# Altium schematic sheet Sensor.SchDoc
size A
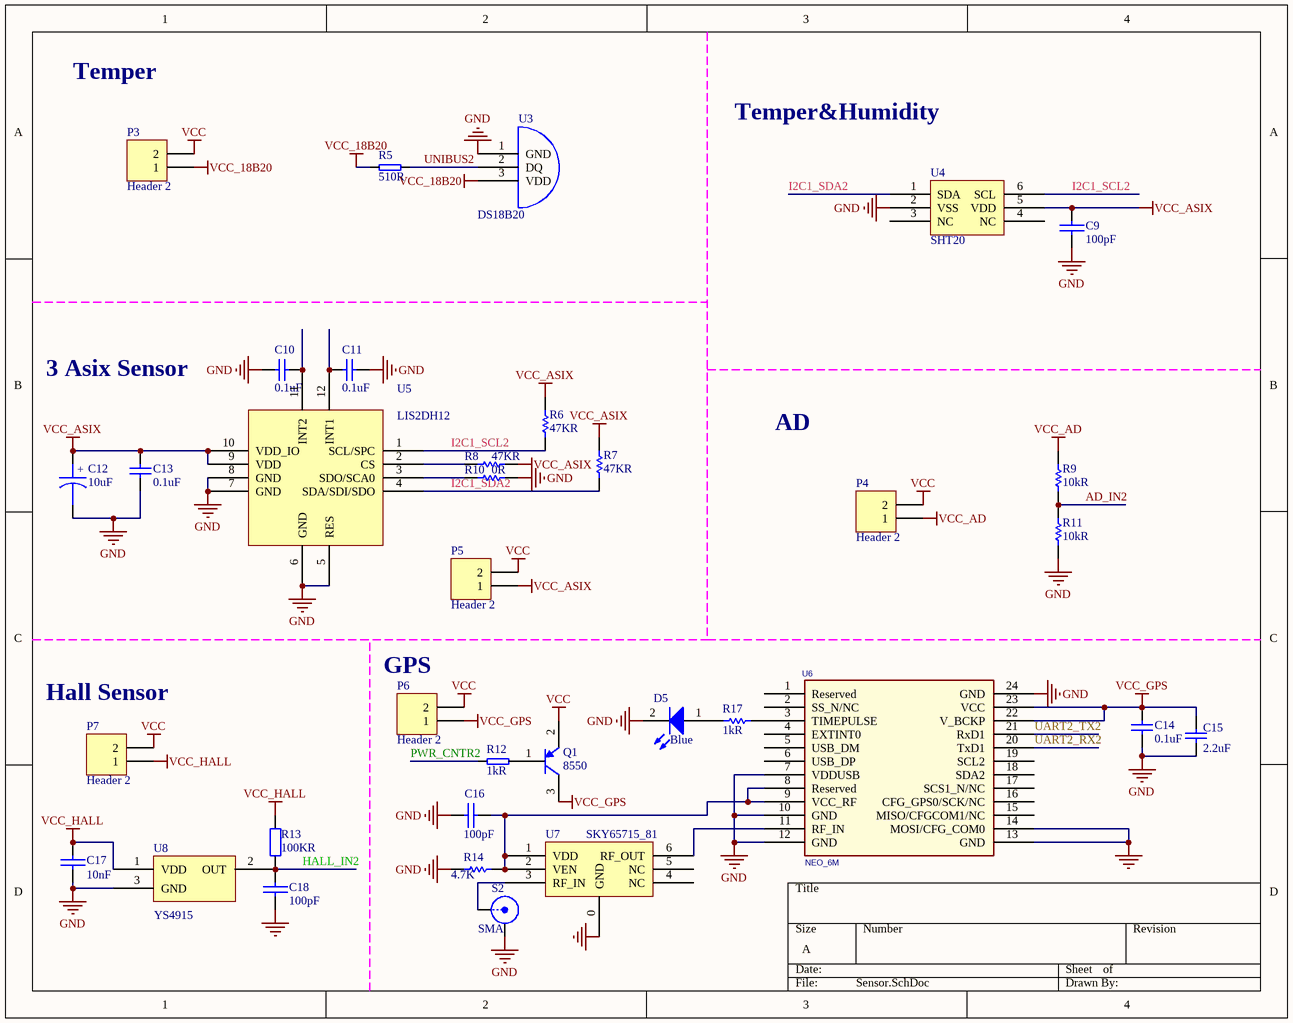
[diagram p0: Sensor.SchDoc]

## Parts
C9  100pF  [0603RF]
C10  0.1uF  [0603RF]
C11  0.1uF  [0603RF]
C12  10uF  [0805]
C13  0.1uF  [0603RF]
C14  0.1uF  [0603RF]
C15  2.2uF  [0603RF]
C16  100pF  [0603RF]
C17  10nF  [0603RF]
C18  100pF  [0603RF]
D5  Blue  [LED0603]
P3  Header 2  [HDR1X2]
P4  Header 2  [HDR1X2]
P5  Header 2  [HDR1X2]
P6  Header 2  [HDR1X2]
P7  Header 2  [HDR1X2]
Q1  8550  [SO-G3/Z3.3]
R5  510R  [0603RF]
R6  47KR  [0603RF]
R7  47KR  [0603RF]
R8  47KR  [0603RF]
R9  10kR  [0603RF]
R10  0R  [0603RF]
R11  10kR  [0603RF]
R12  1kR  [0603RF]
R13  100KR  [0603RF]
R14  4.7K  [0603RF]
R17  1kR  [0603RF]
S2  SMA  [SMA]
U3  DS18B20  [LC-TO-92(TO-92-3)]
U4  SHT20  [QFN6]
U5  LIS2DH12  [LIS2DH12]
U6  NEO_6M  [NEO-5]
U7  SKY65715_81  [SKY65715]
U8  YS4915  [SOT-23]

## Nets
GND: C9.1 C10.2 C11.1 C12.2 C13.1 C14.1 C15.2 C16.1 C17.1 C18.1 D5.2(K) R10.2 R11.2 R14.2 S2.2(Y) U3.1(GND) U4.2(VSS) U5.5(RES) U5.6(GND) U5.7(GND) U5.8(GND) U6.7(VDDUSB) U6.10(GND) U6.12(GND) U6.13(GND) U6.14(MOSI/CFG_COM0) U6.24(GND) U7.0(GND) U8.3(GND)
VCC: P3.2 P4.2 P5.2 P6.2 P7.2 Q1.2(E)
VCC_18B20: P3.1 R5.1 U3.3(VDD)
VCC_AD: P4.1 R9.1
VCC_ASIX: C9.2 C12.1 C13.2 P5.1 R6.2 R7.2 R8.2 U4.5(VDD) U5.9(VDD) U5.10(VDD_IO)
VCC_GPS: C14.2 C15.1 P6.1 Q1.3(C) U6.22(V_BCKP) U6.23(VCC)
VCC_HALL: C17.2 P7.1 R13.1 U8.1(VDD)
AD_IN2: R9.2 R11.1
HALL_IN2: C18.2 R13.2 U8.2(OUT)
I2C1_SCL2: R6.1 U4.6(SCL) U5.1(SCL/SPC)
I2C1_SDA2: R7.1 U4.1(SDA) U5.4(SDA/SDI/SDO)
PWR_CNTR2: R12.2
UART2_RX2: U6.20(TxD1)
UART2_TX2: U6.21(RxD1)
UNIBUS2: R5.2 U3.2(DQ)
NetC10_1: C10.1 U5.11(INT2)
NetC11_2: C11.2 U5.12(INT1)
NetC16_2: C16.2 R14.1 U6.8(Reserved) U6.9(VCC_RF) U7.1(VDD) U7.2(VEN)
NetD5_1: D5.1(A) R17.1
NetQ1_1: Q1.1(B) R12.1
NetR8_1: R8.1 U5.2(CS)
NetR10_1: R10.1 U5.3(SDO/SCA0)
NetR17_2: R17.2 U6.3(TIMEPULSE)
NetS2_1: S2.1(X) U7.3(RF_IN)
NetU6_11: U6.11(RF_IN) U7.6(RF_OUT)

Not connected (* = marked no-connect by the designer): U4 3(NC) 4(NC); U6 1(Reserved) 2(SS_N/NC) 4(EXTINT0) 5(USB_DM) 6(USB_DP) 15(MISO/CFGCOM1/NC) 16(CFG_GPS0/SCK/NC) 17(SCS1_N/NC) 18(SDA2) 19(SCL2); U7 4(NC) 5(NC)

## Notes on the sheet
- Temper
- Temper&Humidity
- 3 Asix Sensor
- AD
- (near P7) Hall Sensor
- (near P6) GPS
- (in symbol CAPACITOR POL) +

## Library data of the parts
C9 C17 C18 = CAP: Capacitor
C10 C11 C13-C15 = Cap Semi: Capacitor (Semiconductor SIM Model); Published: 8-Jun-2000; LatestRevisionDate: 29-May-2009; LatestRevisionNote: IPC-7351 Footprint Added.; PackageReference: C1206; Publisher: Altium Limited; PackageDescription: Chip Capacitor
  C10 C11 C13 C14: Value: 0.1uF
  C15: Value: 2.2uF
C12 = CAPACITOR POL: Capacitor
C16 = 100pF/50V,10%,C0603: Capacitor,100pF/50V,10%,C0603
D5 = LED2: Typical RED, GREEN, YELLOW, AMBER GaAs LED; Published: 8-Jun-2000; Revision: July-2002: Re-released for DXP Platform.; Publisher: Altium Limited
P3-P7 = Header 2: Header, 2-Pin; LatestRevisionDate: 17-Jul-2002; LatestRevisionNote: Re-released for DXP Platform.; Publisher: Altium Limited
Q1 = 8550: PNP三极管
R5 R12 = R
R6-R11 R17 = Res Semi: Semiconductor Resistor; Published: 8-Jun-2000; LatestRevisionDate: 17-Jul-2002; LatestRevisionNote: Re-released for DXP Platform.; PackageReference: AXIAL-0.5; Publisher: Altium Limited; PackageDescription: Axial Device, Thru-Hole; 2 Leads; 0.5 in Pin Spacing
  R6-R8: Value: 47KR
  R9 R11: Value: 10kR
  R10: Value: 0R
  R17: Value: 1kR
R13 = Res2: Resistor; Published: 8-Jun-2000; LatestRevisionDate: 17-Jul-2002; LatestRevisionNote: Re-released for DXP Platform.; PackageReference: AXIAL-0.4; Publisher: Altium Limited; PackageDescription: Axial Device, Thru-Hole; 2 Leads; 0.4 in Pin Spacing; Value: 100KR
R14 = 0R,5%,R1206
S2 = SMB: SMB Straight Connector; LatestRevisionDate: 17-Jul-2002; LatestRevisionNote: Re-released for DXP Platform.; Publisher: Altium Limited
U6 = NEO_0: GPS模块
U7 = SKY65715
U8 = ES248L